# Altium schematic sheet Squibs.SchDoc: Single Squib Connection
size 203 x 127 mm; DrawnBy: Kace Chandler; DocumentNumber: 10; SheetNumber: 10; SheetTotal: 23
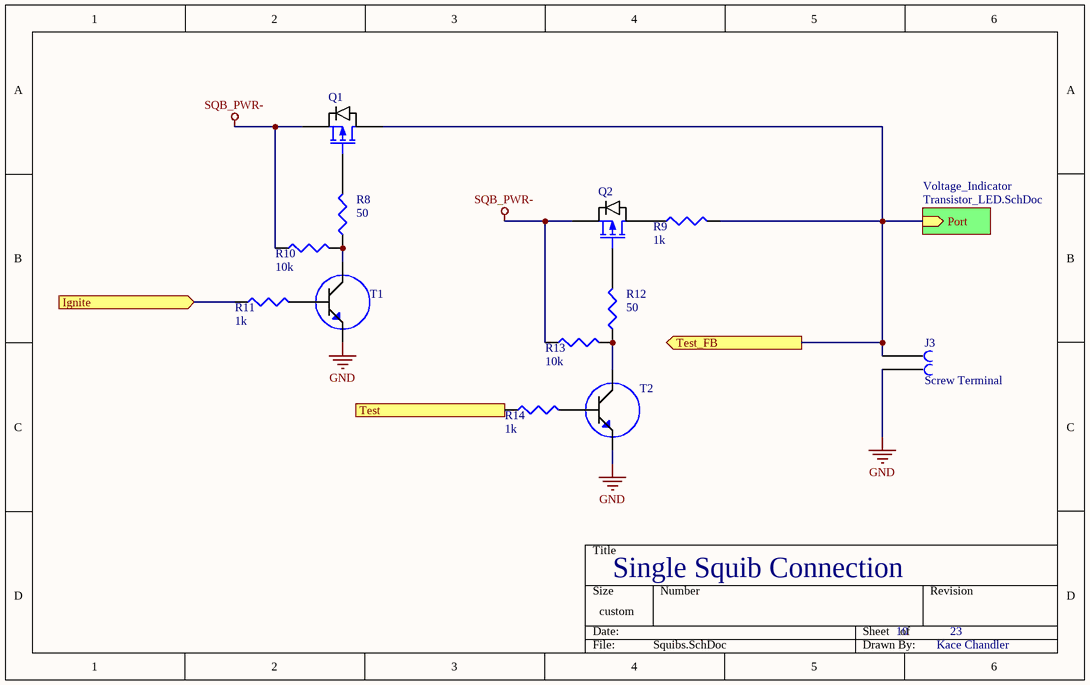
[diagram p0: Squibs.SchDoc]

## Parts
J3  Screw Terminal  [Screw Terminal]
Q1  P-Channel  [P Channel MOSFET]  (value not drawn)
Q2  P-Channel  [P Channel MOSFET]  (value not drawn)
R8  value 50  (hidden comment: Res3)
R9  value 1k  (hidden comment: Res3)
R10  value 10k  (hidden comment: Res3)
R11  value 1k  (hidden comment: Res3)
R12  value 50  (hidden comment: Res3)
R13  value 10k  (hidden comment: Res3)
R14  value 1k  (hidden comment: Res3)
T1  MMBT2222ALT1  [BJT]  (value not drawn)
T2  MMBT2222ALT1  [BJT]  (value not drawn)

## Sub-sheets
Voltage_Indicator = Transistor_LED.SchDoc: Port (in)

## Ports
Ignite (in), Test (in), Test_FB (out)

## Nets
GND: J3.2 T1.2(E) T2.2(E)
SQB_PWR-: Q1.2(S) Q2.2(S) R10.1 R13.1
Ignite: R11.1 ; port Ignite
Test: R14.1 ; port Test
Test_FB: J3.1 Q1.3(D) R9.2 ; port Test_FB, sheet Voltage_Indicator/Port
NetQ1_1: Q1.1(G) R8.2
NetQ2_1: Q2.1(G) R12.2
NetQ2_3: Q2.3(D) R9.1
NetR8_1: R8.1 R10.2 T1.3(C)
NetR11_2: R11.2 T1.1(B)
NetR12_1: R12.1 R13.2 T2.3(C)
NetR14_2: R14.2 T2.1(B)

## Library data of the parts
R8-R14 = Res3: Resistor; Published: 8-Jun-2000; LatestRevisionDate: 29-May-2009; LatestRevisionNote: IPC-7351 Footprint Added.; PackageReference: J1-0603; Publisher: Altium Limited; PackageDescription: Chip Resistor
T1 T2 = BJT NPN: Trans NPN 40V 0.6A SOT23; MF: ON Semiconductor; SnapEDA_Link: https://www.snapeda.com/parts/MMBT2222ALT1/ON%20Semiconductor/view-part/?ref=snap; Price: None; Availability: Unavailable; MP: MMBT2222ALT1; Package: SOT-23 Motorola; Value: *; Supplier 1: Digi-Key; Supplier Part Number 1: MMBT2222ATPMSCT-ND
J3 = Screw Terminal: Supplier 1: Digi-Key; Supplier Part Number 1: A112762-ND
Q1 Q2 = P-Channel: Supplier 1: Digi-Key; Supplier Part Number 1: SI2343CDS-T1-GE3CT-ND